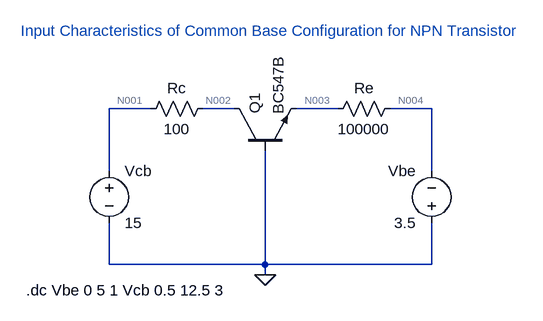
[diagram p0: schematic Assignment 5c (i).asc]
Assignment 5c (i).asc, the LTspice schematic file:
Version 4.1
SHEET 1 880 680
WIRE 48 96 -16 96
WIRE 176 96 128 96
WIRE 336 96 272 96
WIRE 480 96 416 96
WIRE -16 192 -16 96
WIRE 480 192 480 96
WIRE -16 336 -16 272
WIRE 224 336 224 160
WIRE 224 336 -16 336
WIRE 480 336 480 272
WIRE 480 336 224 336
WIRE 224 352 224 336
FLAG 224 352 0
SYMBOL npn 176 160 R270
SYMATTR InstName Q1
SYMATTR Value BC547B
SYMBOL voltage 480 288 R180
WINDOW 0 24 96 Left 2
WINDOW 3 24 16 Left 2
WINDOW 123 0 0 Left 0
WINDOW 39 0 0 Left 0
SYMATTR InstName Vbe
SYMATTR Value 3.5
SYMBOL voltage -16 176 R0
WINDOW 123 0 0 Left 0
WINDOW 39 0 0 Left 0
SYMATTR InstName Vcb
SYMATTR Value 15
SYMBOL res 144 80 R90
WINDOW 0 0 56 VBottom 2
WINDOW 3 32 56 VTop 2
SYMATTR InstName Rc
SYMATTR Value 100
SYMBOL res 432 80 R90
WINDOW 0 0 56 VBottom 2
WINDOW 3 32 56 VTop 2
SYMATTR InstName Re
SYMATTR Value 100000
TEXT -152 -24 Left 2 ;Input Characteristics of Common Base Configuration for NPN Transistor
TEXT -144 376 Left 2 !.dc Vbe 0 5 1 Vcb 0.5 12.5 3

The netlist it stands for:
* Assignment 5c (i).asc
Q1 N002 0 N003 0 BC547B
Vbe 0 N004 3.5
Vcb N001 0 15
Rc N002 N001 100
Re N004 N003 100000
.model NPN NPN
.model PNP PNP
.lib standard.bjt
* Input Characteristics of Common Base Configuration for NPN Transistor
.dc Vbe 0 5 1 Vcb 0.5 12.5 3
.backanno
.end

* Results of the author's LTspice run, read from the files saved beside the schematic
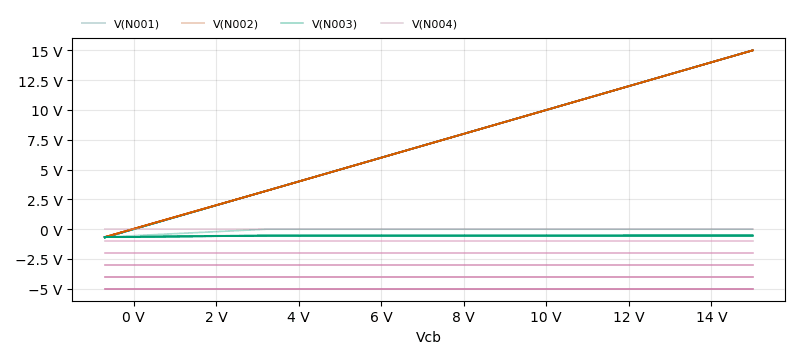
[diagram p1: DC transfer characteristic of Assignment 5c (i).asc, plotted from the saved traces]
* DC transfer characteristic, 6 runs:
*   V(N001) [run 1]: -700 mV at Vcb=-700 mV, 15 V at Vcb=15 V, min -700 mV, max 15 V
*   V(N001) [run 2]: -700 mV at Vcb=-700 mV, 15 V at Vcb=15 V, min -700 mV, max 15 V
*   V(N001) [run 3]: -700 mV at Vcb=-700 mV, 15 V at Vcb=15 V, min -700 mV, max 15 V
*   V(N001) [run 4]: -700 mV at Vcb=-700 mV, 15 V at Vcb=15 V, min -700 mV, max 15 V
*   V(N001) [run 5]: -700 mV at Vcb=-700 mV, 15 V at Vcb=15 V, min -700 mV, max 15 V
*   V(N001) [run 6]: -700 mV at Vcb=-700 mV, 15 V at Vcb=15 V, min -700 mV, max 15 V
*   V(N002) [run 1]: -660.6 mV at Vcb=-700 mV, 15 V at Vcb=15 V, min -660.6 mV, max 15 V
*   V(N002) [run 2]: -661 mV at Vcb=-700 mV, 15 V at Vcb=15 V, min -661 mV, max 15 V
*   V(N002) [run 3]: -661.4 mV at Vcb=-700 mV, 15 V at Vcb=15 V, min -661.4 mV, max 15 V
*   V(N002) [run 4]: -661.8 mV at Vcb=-700 mV, 15 V at Vcb=15 V, min -661.8 mV, max 15 V
*   V(N002) [run 5]: -662.2 mV at Vcb=-700 mV, 15 V at Vcb=15 V, min -662.2 mV, max 15 V
*   V(N002) [run 6]: -662.6 mV at Vcb=-700 mV, 15 V at Vcb=15 V, min -662.6 mV, max 15 V
*   V(N003) [run 1]: -662.7 mV at Vcb=-700 mV, 2.957 nV at Vcb=15 V, min -662.7 mV, max 2.957 nV
*   V(N003) [run 2]: -663.3 mV at Vcb=-700 mV, -494.6 mV at Vcb=15 V, min -663.3 mV, max -494.6 mV
*   V(N003) [run 3]: -663.8 mV at Vcb=-700 mV, -522.6 mV at Vcb=15 V, min -663.8 mV, max -522.6 mV
*   V(N003) [run 4]: -664.3 mV at Vcb=-700 mV, -535.9 mV at Vcb=15 V, min -664.3 mV, max -535.9 mV
*   V(N003) [run 5]: -664.8 mV at Vcb=-700 mV, -544.7 mV at Vcb=15 V, min -664.8 mV, max -544.7 mV
*   V(N003) [run 6]: -665.3 mV at Vcb=-700 mV, -551.3 mV at Vcb=15 V, min -665.3 mV, max -551.3 mV
*   V(N004) [run 1]: 0 V at Vcb=-700 mV, 0 V at Vcb=15 V, min 0 V, max 0 V
*   V(N004) [run 2]: -1 V at Vcb=-700 mV, -1 V at Vcb=15 V, min -1 V, max -1 V
*   V(N004) [run 3]: -2 V at Vcb=-700 mV, -2 V at Vcb=15 V, min -2 V, max -2 V
*   V(N004) [run 4]: -3 V at Vcb=-700 mV, -3 V at Vcb=15 V, min -3 V, max -3 V
*   V(N004) [run 5]: -4 V at Vcb=-700 mV, -4 V at Vcb=15 V, min -4 V, max -4 V
*   V(N004) [run 6]: -5 V at Vcb=-700 mV, -5 V at Vcb=15 V, min -5 V, max -5 V